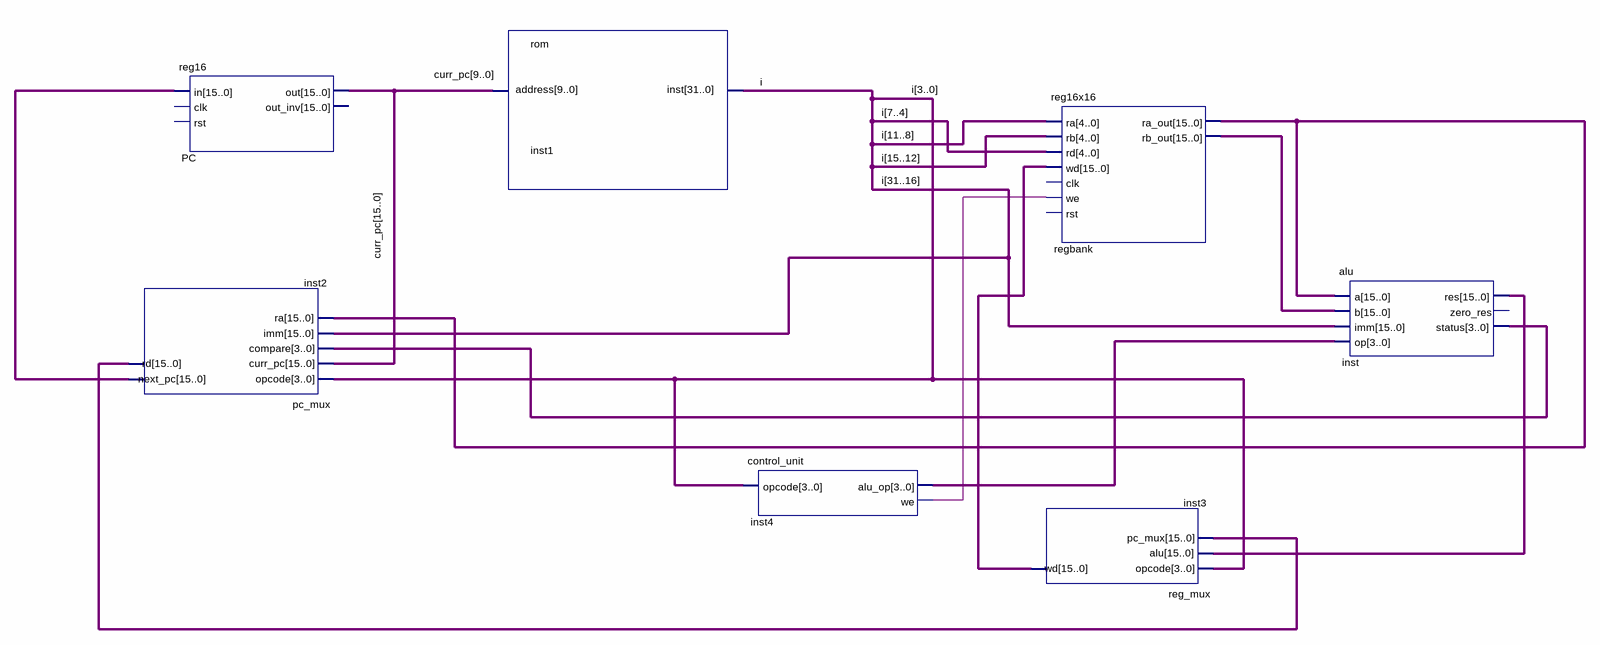
[diagram p0: schematic sheet]
// Quartus schematic cpu.bdf as structural Verilog: 7 symbols, 0 pins
module cpu (
);

  wire i_1bit, inst4_we;
  wire [3:0] inst4_alu_op, inst_status;
  wire [15:0] curr_pc, inst2_next_pc, inst2_rd, inst3_wd, inst_res, regbank_ra_out, regbank_rb_out;
  wire [31:0] i;

  pc_mux inst2 (
    .opcode(i[3:0]), .curr_pc(curr_pc), .compare(inst_status), .imm(i[31:16]), .ra(regbank_ra_out),
    .next_pc(inst2_next_pc), .rd(inst2_rd));
  reg16 PC (.in(inst2_next_pc), .out(curr_pc));  // open: clk, rst, out_inv
  rom inst1 (.address(curr_pc[9:0]), .inst(i_1bit));
  control_unit inst4 (.opcode(i[3:0]), .alu_op(inst4_alu_op), .we(inst4_we));
  reg16x16 regbank (
    .ra(i[11:8]), .rb(i[15:12]), .rd(i[7:4]), .wd(inst3_wd), .we(inst4_we), .ra_out(regbank_ra_out),
    .rb_out(regbank_rb_out));  // open: clk, rst
  reg_mux inst3 (.opcode(i[3:0]), .alu(inst_res), .pc_mux(inst2_rd), .wd(inst3_wd));
  alu inst (
    .a(regbank_ra_out), .b(regbank_rb_out), .imm(i[31:16]), .op(inst4_alu_op), .res(inst_res),
    .status(inst_status));  // open: zero_res
endmodule
